# Altium schematic sheet cameras.SchDoc
size A4; SheetNumber: 1; SheetTotal: 1
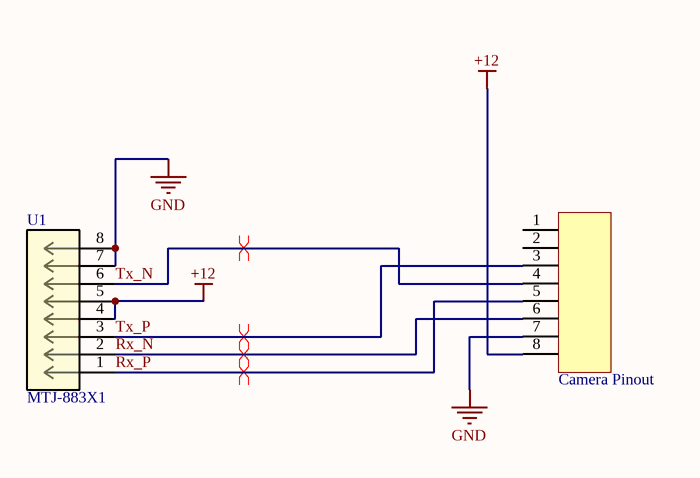
[diagram p0: cameras.SchDoc]

## Parts
?  Camera Pinout  [PCBComponent_1]
U1  MTJ-883X1  [CONN_MTJ-883X1_ADM]

## Nets
+12: ?.8 U1.4 U1.5
GND: ?.7 U1.7 U1.8
Rx_N: ?.6 U1.2
Rx_P: ?.5 U1.1
Tx_N: ?.4 U1.6
Tx_P: ?.3 U1.3

Not connected (* = marked no-connect by the designer): ? 1 2

## Layout directives
differential pair: Rx_N, Rx_P, Tx_N, Tx_P

## Library data of the parts
? = Component_1
U1 = MTJ-883X1: No Description Available; Mfr_Name: ADAM TECHNOLOGIES INC; RefDes: RefDes; Type: Type